# EAGLE schematic reset_button (EAGLE 9.6.2)
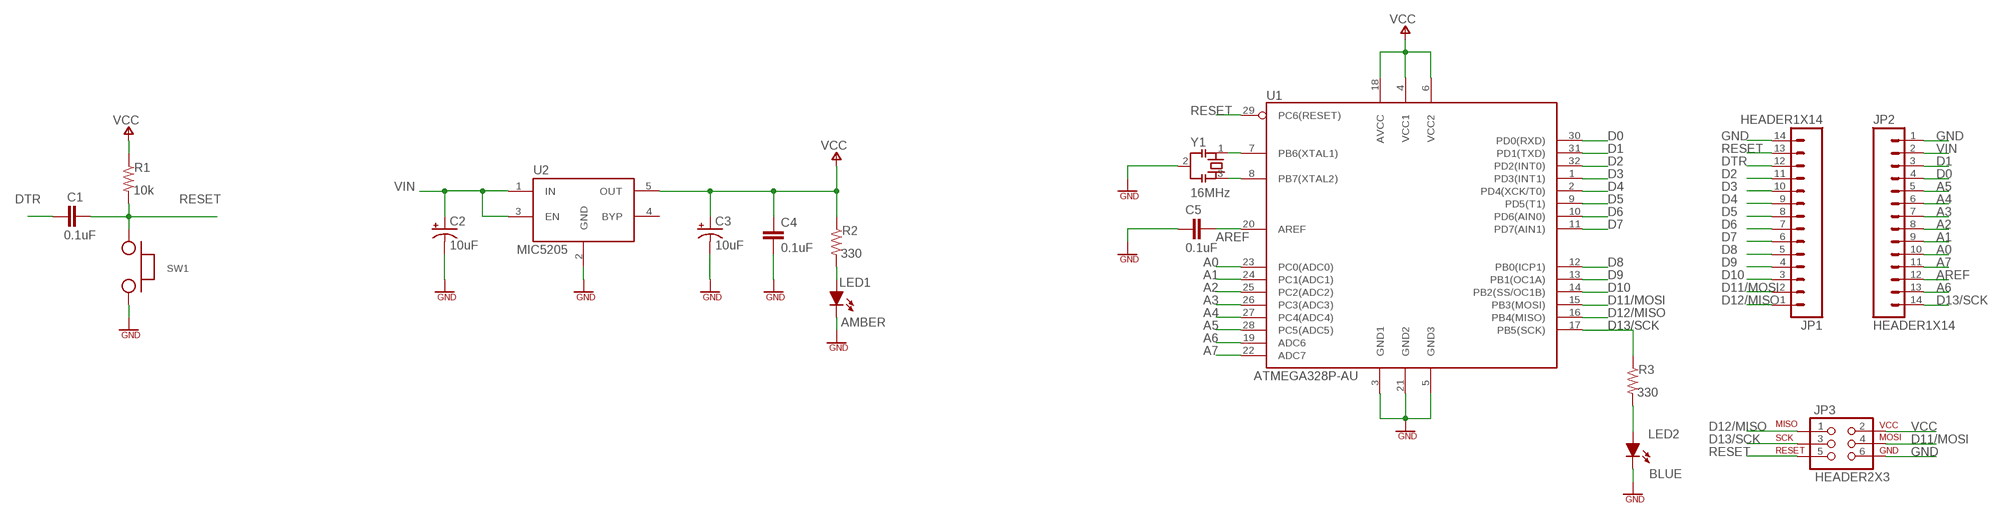
[diagram p0: schematic, sheet 1]

## Parts
C1  0.1uF  CAP_0603  [SMD0603]
C2  10uF  CAP_TANT  [EIA3216]
C3  10uF  CAP_TANT  [EIA3216]
C4  0.1uF  CAP_0603  [SMD0603]
C5  0.1uF  CAP_0603  [SMD0603]
JP1  HEADER1X14  [1X14]
JP2  HEADER1X14  [1X14]
JP3  HEADER2X3  [2X3]
LED1  AMBER  LED_0805  [LED_0805]
LED2  BLUE  LED_0805  [LED_0805]
R1  10k  RES_0603  [SMD0603]
R2  330  RES_0603  [SMD0603]
R3  330  RES_0603  [SMD0603]
SW1  SWITCH  [SWITCH-SPST]
U1  ATMEGA328P-AU  [TQFP32]
U2  MIC5205  [SOT23-5]
Y1  16MHz  CSTCE  [CSTCE]

## Nets
A0: JP2.10 U1.23(PC0(ADC0))
A1: JP2.9 U1.24(PC1(ADC1))
A2: JP2.8 U1.25(PC2(ADC2))
A3: JP2.7 U1.26(PC3(ADC3))
A4: JP2.6 U1.27(PC4(ADC4))
A5: JP2.5 U1.28(PC5(ADC5))
A6: JP2.13 U1.19(ADC6)
A7: JP2.11 U1.22(ADC7)
AREF [AREF]: C5.1 JP2.12 U1.20(AREF)
D0: JP2.4 U1.30(PD0(RXD))
D1: JP2.3 U1.31(PD1(TXD))
D2: JP1.11 U1.32(PD2(INT0))
D3: JP1.10 U1.1(PD3(INT1))
D4: JP1.9 U1.2(PD4(XCK/T0))
D5: JP1.8 U1.9(PD5(T1))
D6: JP1.7 U1.10(PD6(AIN0))
D7: JP1.6 U1.11(PD7(AIN1))
D8: JP1.5 U1.12(PB0(ICP1))
D9: JP1.4 U1.13(PB1(OC1A))
D10: JP1.3 U1.14(PB2(SS/OC1B))
D11/MOSI: JP1.2 JP3.4 U1.15(PB3(MOSI))
D12/MISO: JP1.1 JP3.1 U1.16(PB4(MISO))
D13/SCK: JP2.14 JP3.3 R3.1 U1.17(PB5(SCK))
DTR: C1.1 JP1.12
GND [GND]: C2.C(-) C3.C(-) C4.2 C5.2 JP1.14 JP2.1 JP3.6 LED1.C LED2.C SW1.2 U1.3(GND1) U1.5(GND3) U1.21(GND2) U2.2(GND) Y1.2
N$3: LED1.A R2.2
N$4: U1.7(PB6(XTAL1)) Y1.1
N$5: U1.8(PB7(XTAL2)) Y1.3
N$11: LED2.A R3.2
RESET: C1.2 JP1.13 JP3.5 R1.2 SW1.1 U1.29(PC6(RESET))
VCC [VCC]: C3.A(+) C4.1 JP3.2 R1.1 R2.1 U1.4(VCC1) U1.6(VCC2) U1.18(AVCC) U2.5(OUT)
VIN [VIN]: C2.A(+) JP2.2 U2.1(IN) U2.3(EN)
Unconnected: U2.4(BYP)

## Library data of the parts
C1 C4 C5 = eagle-book:CAP: Non-polarized capacitor
C2 C3 = eagle-book:CAP_TANT: Polarized capacitor (Tantalum)
JP1 JP2 = eagle-book:HEADER1X14: 14-pin header with pins spaced 0.1" apart
JP3 = eagle-book:HEADER2X3: 6-pin header with pins spaced 0.1" apart (HEADD6)
LED1 LED2 = eagle-book:LED: Light Emitting Diode
R1-R3 = eagle-book:RES: Resistor
SW1 = eagle-book:SWITCH: Two-input single pole, single throw (SPST) switch
U1 = eagle-book:ATMEGA328P: Atmel 32-pin 8-bit microcontroller
U2 = eagle-book:MIC5205: 5-volt voltage regulator (UA78M05)
Y1 = eagle-book:CSTCE: SMD resonator from Murata (CSTCE16M0V53-S0)

## Net classes
0 default: width 0.203 mm
1 VCC: width 0.305 mm, drill 0.406 mm
2 VIN: width 0.305 mm, drill 0.406 mm
3 AREF: width 0.254 mm, drill 0.406 mm
4 GND: width 0.254 mm, drill 0.406 mm